# EAGLE design test (EAGLE 9.4.2)
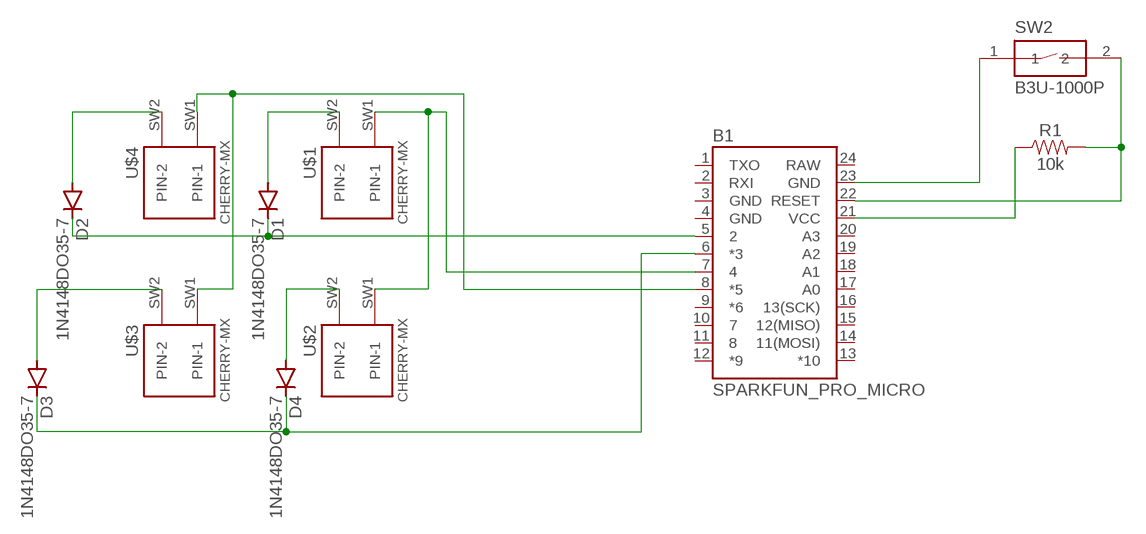
[diagram p0: schematic, sheet 1]

## Parts
B1  SPARKFUN_PRO_MICRO  [SPARKFUN_PRO_MICRO]
D1  1N4148DO35-7  [DO35-7]
D2  1N4148DO35-7  [DO35-7]
D3  1N4148DO35-7  [DO35-7]
D4  1N4148DO35-7  [DO35-7]
R1  10k  10KOHM-0402-1/16W-1%  [0402]
SW2  B3U-1000P  [B3U-1000P]
U$1  CHERRY-MX  [CHERRY-MX]
U$2  CHERRY-MX  [CHERRY-MX]
U$3  CHERRY-MX  [CHERRY-MX]
U$4  CHERRY-MX  [CHERRY-MX]

## Nets
N$1: B1.22(RESET) R1.2 SW2.2
N$2: B1.21(VCC) R1.1
N$3: B1.23(GND) SW2.1
N$4: B1.5 D1.C D2.C
N$5: D1.A U$1.SW2(PIN-2)
N$6: B1.7 U$1.SW1(PIN-1) U$2.SW1(PIN-1)
N$7: B1.6(*3) D3.C D4.C
N$8: D2.A U$4.SW2(PIN-2)
N$9: B1.8(*5) U$3.SW1(PIN-1) U$4.SW1(PIN-1)
N$10: D4.A U$2.SW2(PIN-2)
N$12: D3.A U$3.SW2(PIN-2)
Unconnected: B1.1(TXO) B1.2(RXI) B1.9(*6) B1.10 B1.11 B1.12(*9) B1.13(*10) B1.14(11(MOSI)) B1.15(12(MISO)) B1.16(13(SCK)) B1.17(A0) B1.18(A1) B1.19(A2) B1.20(A3)

## Power pins joined to a net without a drawn wire
GND: B1.3(GND) B1.4(GND)
RAW: B1.24(RAW)

## Library data of the parts
B1 = SparkFun-Boards:SPARKFUN_PRO_MICRO: SparkFun Pro Micro Atmega32U4 compatible footprint. SparkFun Products: 3.3V/8MHz <https://www.sparkfun.com/products/12587> 5V/16MHz <https://www.sparkfun.com/products/12640>; OC_NEWARK: unknown
D1-D4 = diode:1N4148: DIODE high speed (Philips); OC_NEWARK: unknown
R1 = SparkFun-Resistors:10KOHM: 10kΩ resistor A resistor is a passive two-terminal electrical component that implements electrical resistance as a circuit element. Resistors act to reduce current flow, and, at the same time, act to lower voltage levels within circuits. - Wikipedia; MPN: MCWR06X1002FTL; OC_NEWARK: 94X1379; PROD_ID: RES-14241
SW2 = Switch:B3U-1000P: SWITCH TACTILE SPST-NO 0.05A 12V Manufacturer's datasheet <https://omronfs.omron.com/en_US/ecb/products/pdf/en-b3u.pdf>; CREATED_BY: PCBLayout.com; DIGI_KEY_PART_NUMBER: SW1020CT-ND; MANUFACTURER: Omron Electronics Inc-EMC Div; MPN: B3U-1000P; OC_NEWARK: 78M0188; PACKAGE: SPST-NO
U$1-U$4 = cherrymx:CHERRY-MX: Cherry MX series keyswitch

## Board
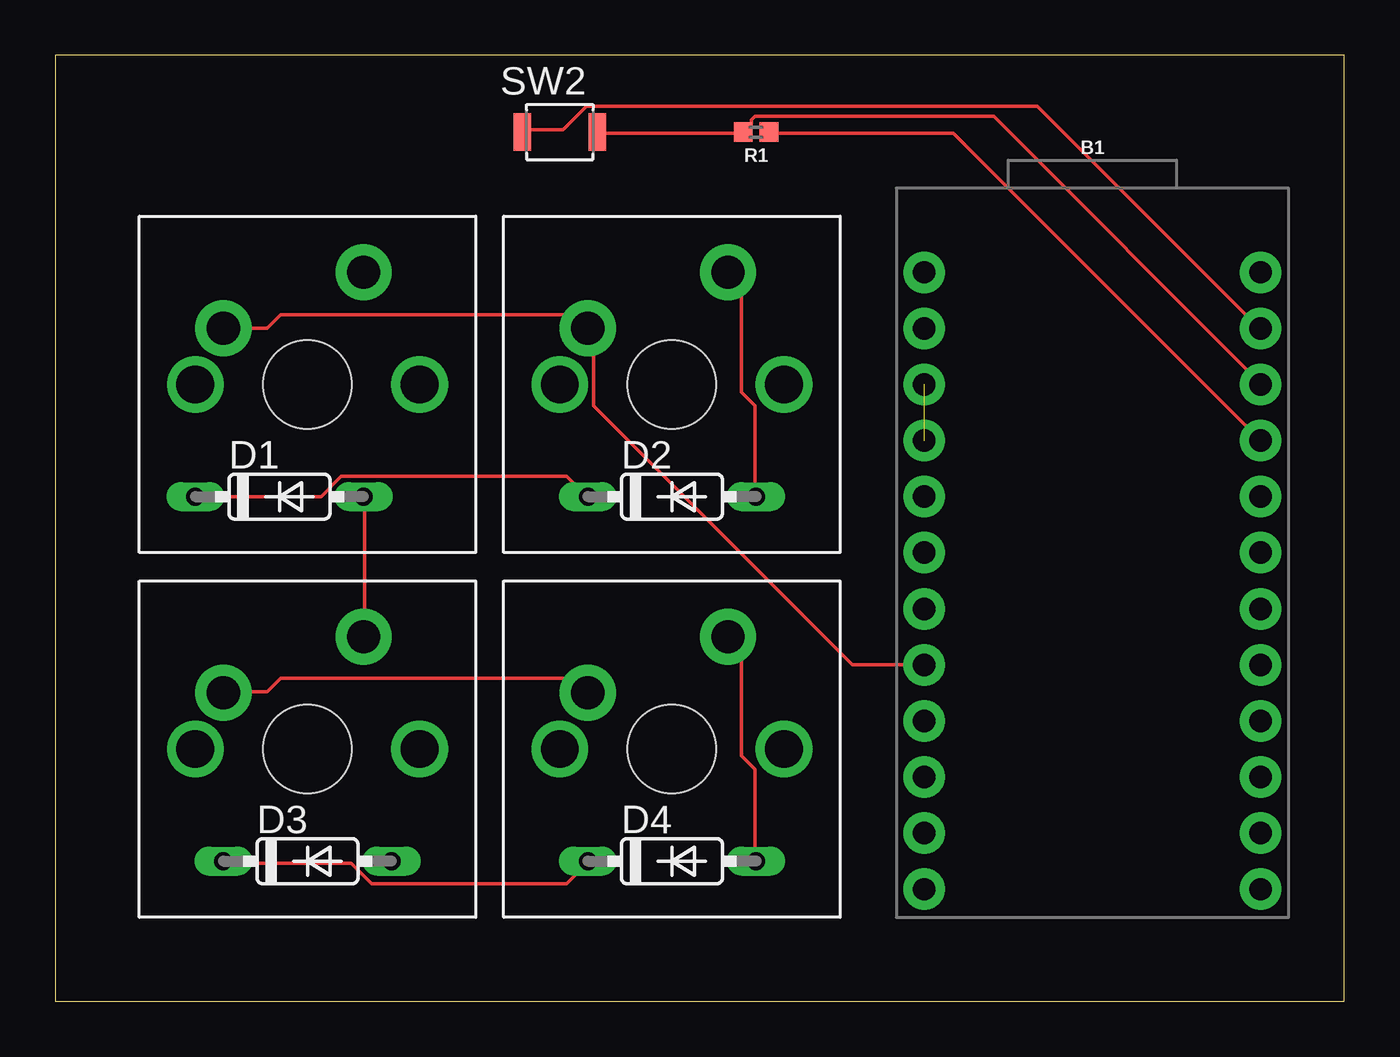
[diagram p1: board, top side]
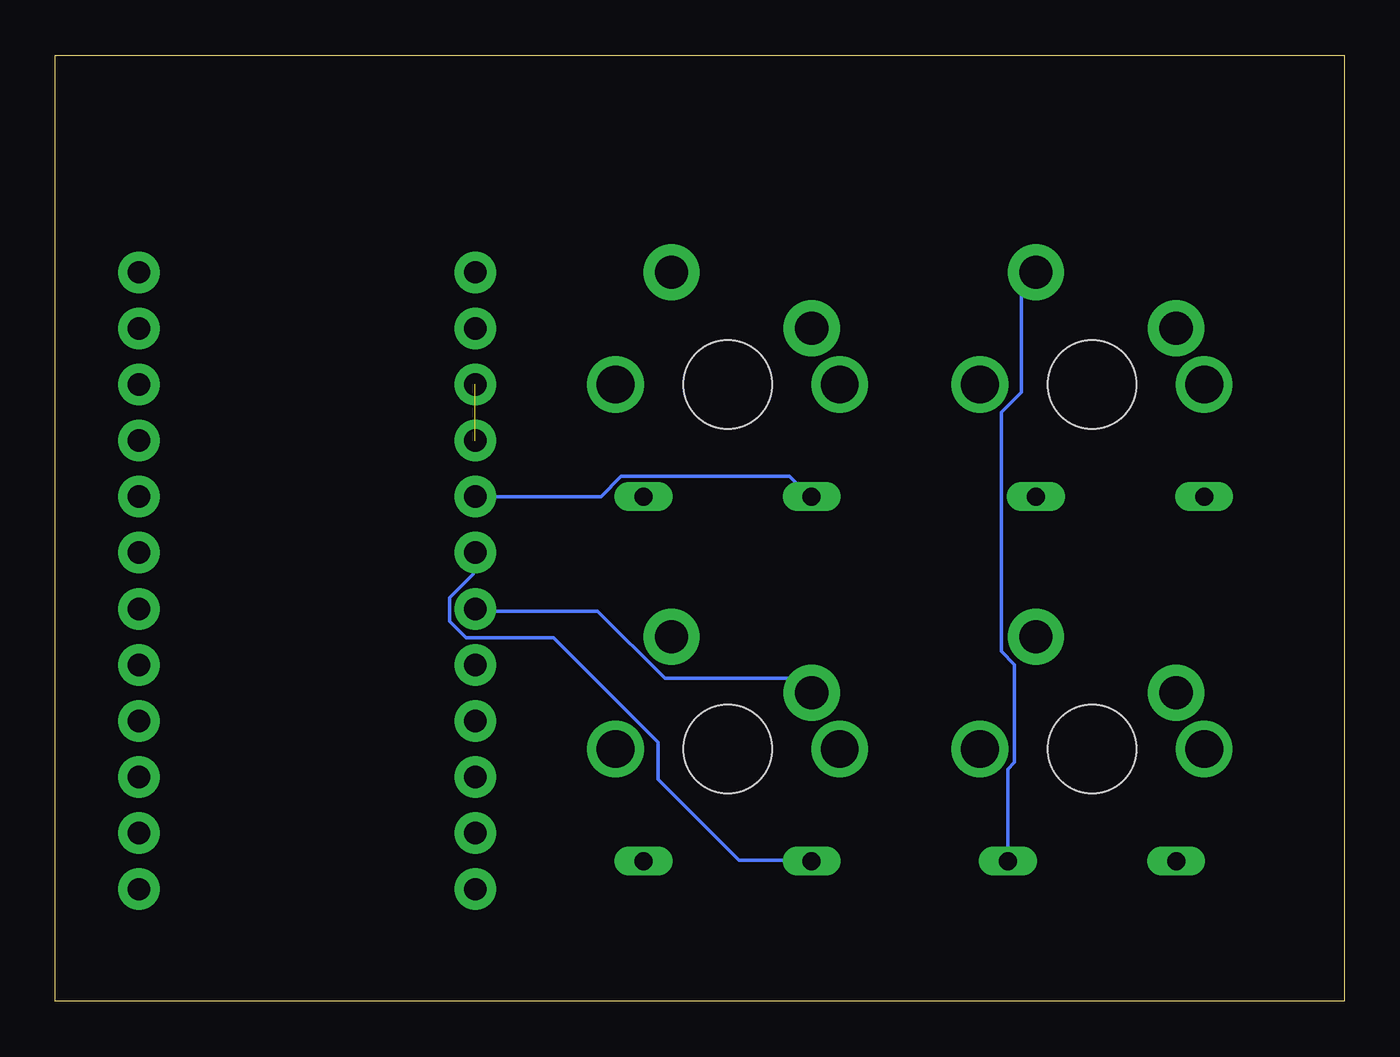
[diagram p2: board, bottom side, seen from below]

Size 58.4 x 42.85 mm. Coordinates in mm from the lower left corner, seen from the top.
Outline: 0,0 58.4,0 58.4,42.85 0,42.85 0,0
Copper layers (1*16): Top 0.035mm / dielectric 1.5mm / Bottom 0.035mm
Design rules "default": minimum track width 6mil, minimum drill 0.35mm, track to track 6mil, track to pad 6mil, pad to pad 6mil, via to via 6mil, smd to smd 6mil, copper to edge 40mil, drill to drill 6mil, minimum pad ring 10mil, minimum via ring 8mil, stop-mask expansion 4mil, vias tented up to drill 0mil, thermal gap 10mil

### Footprints (pad centres in the part's own frame; a part is rotated, then mirrored left to right if it is on the bottom)
SPARKFUN_PRO_MICRO = drill 1.016 pad 1.88: 1 -7.62,12.7; 2 -7.62,10.16; 3 -7.62,7.62; 4 -7.62,5.08; 5 -7.62,2.54; 6 -7.62,0; 7 -7.62,-2.54; 8 -7.62,-5.08; 9 -7.62,-7.62; 10 -7.62,-10.16; 11 -7.62,-12.7; 12 -7.62,-15.24; 13 7.62,-15.24; 14 7.62,-12.7; 15 7.62,-10.16; 16 7.62,-7.62; 17 7.62,-5.08; 18 7.62,-2.54; 19 7.62,0; 20 7.62,2.54; 21 7.62,5.08; 22 7.62,7.62; 23 7.62,10.16; 24 7.62,12.7
DO35-7 = drill 0.813 long: A 3.81,0; C -3.81,0
0402 = smd 0.85 x 0.9: 1 -0.58,0; 2 0.58,0
B3U-1000P = smd 0.8 x 1.7: 1 -1.7,0; 2 1.7,0
CHERRY-MX = drill 1.714 pad 1.93: P$3 -5.08,0; P$4 5.08,0 | drill 1.5 pad 2.54: SW1 -3.81,2.54; SW2 2.54,5.08 | hole 4: 0,0

### Placement (x,y rotation side)
B1  46.99,20.32 0 top
D1  10.16,22.86 0 top
D2  27.94,22.86 0 top
D3  11.43,6.35 0 top
D4  27.94,6.35 0 top
R1  31.75,39.37 180 top
SW2  22.86,39.37 0 top
U$1  11.43,11.43 0 top
U$2  27.94,11.43 0 top
U$3  11.43,27.94 0 top
U$4  27.94,27.94 0 top

### Tracks (layer width: path | path; a pad name or v marks a point on that pad's centre or on a via)
GND  (1 unrouted)
N$1
  Top 0.152: SW2.2 24.69,39.32 31.09,39.32 R1.2 31.24,39.47 31.55,39.78 31.55,39.93 31.7,40.08 42.52,40.08 54.56,28.04 B1.22
N$2
  Top 0.152: B1.21 40.69,39.32 32.46,39.32 R1.1
N$3
  Top 0.152: SW2.1 21.18,39.47 23.01,39.47 24.08,40.54 44.5,40.54 54.56,30.48 B1.23
N$4
  Top 0.152: D1.C 12.04,22.86 12.95,23.77 23.17,23.77 24.08,22.86 D2.C
  Bottom 0.152: B1.5 33.68,22.86 32.77,23.77 25.15,23.77 24.23,22.86 D2.C
N$5
  Top 0.152: D1.A 14.02,22.86 14.02,16.61 U$1.SW2
N$6
  Top 0.152: U$2.SW1 23.47,14.63 10.21,14.63 9.6,14.02 7.62,14.02 U$1.SW1
  Bottom 0.152: B1.7 39.32,17.68 33.83,17.68 30.79,14.63 24.84,14.63 24.23,14.02 U$2.SW1
N$7
  Top 0.152: D3.C 7.62,6.25 13.41,6.25 14.33,5.33 23.17,5.33 24.08,6.25 D4.C
  Bottom 0.152: B1.6 39.47,20.27 39.47,19.35 40.54,18.29 40.54,17.22 39.78,16.46 35.81,16.46 31.09,11.74 31.09,10.06 27.43,6.4 24.23,6.4 D4.C
N$8
  Top 0.152: D2.A 31.7,22.86 31.7,26.98 31.09,27.58 31.09,32.31 30.48,32.92 U$4.SW2
N$9
  Top 0.152: B1.8 36.12,15.24 24.38,26.98 24.38,30.33 24.23,30.48 U$4.SW1 24.08,30.48 23.47,31.09 10.21,31.09 9.6,30.48 U$3.SW1
N$10
  Top 0.152: D4.A 31.7,6.4 31.7,10.52 31.09,11.13 31.09,15.85 30.48,16.46 U$2.SW2
N$12
  Bottom 0.152: D3.A 15.24,10.52 14.94,10.82 14.94,15.24 15.55,15.85 15.55,26.67 14.63,27.58 14.63,32.31 14.02,32.92 U$3.SW2